# EAGLE board ISA Sound Card (EAGLE 9.0.1), part 1 of 2
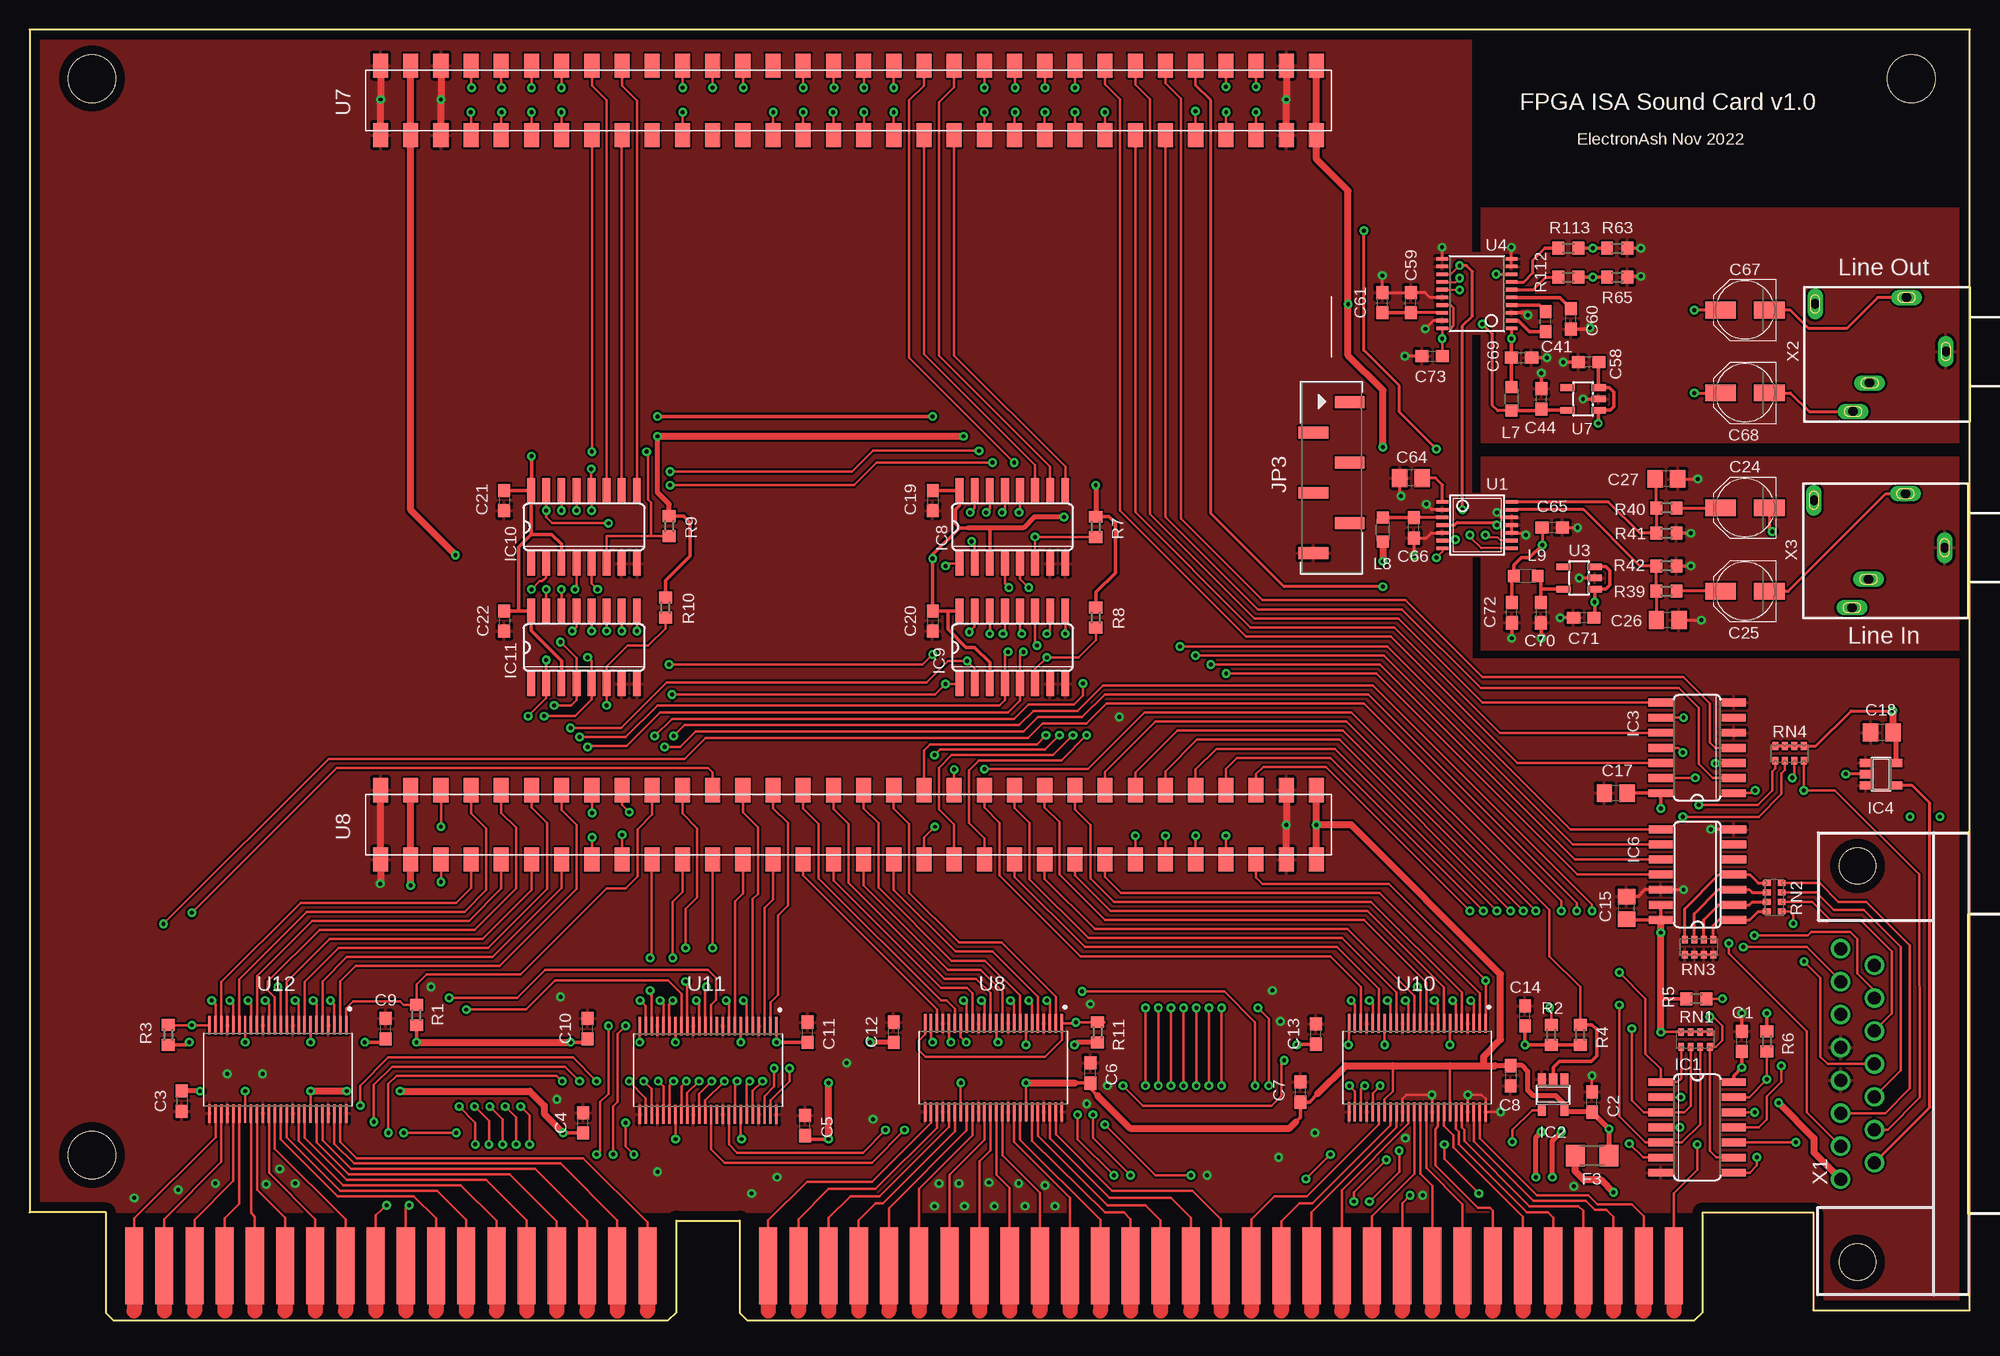
[diagram p4: board, top side]
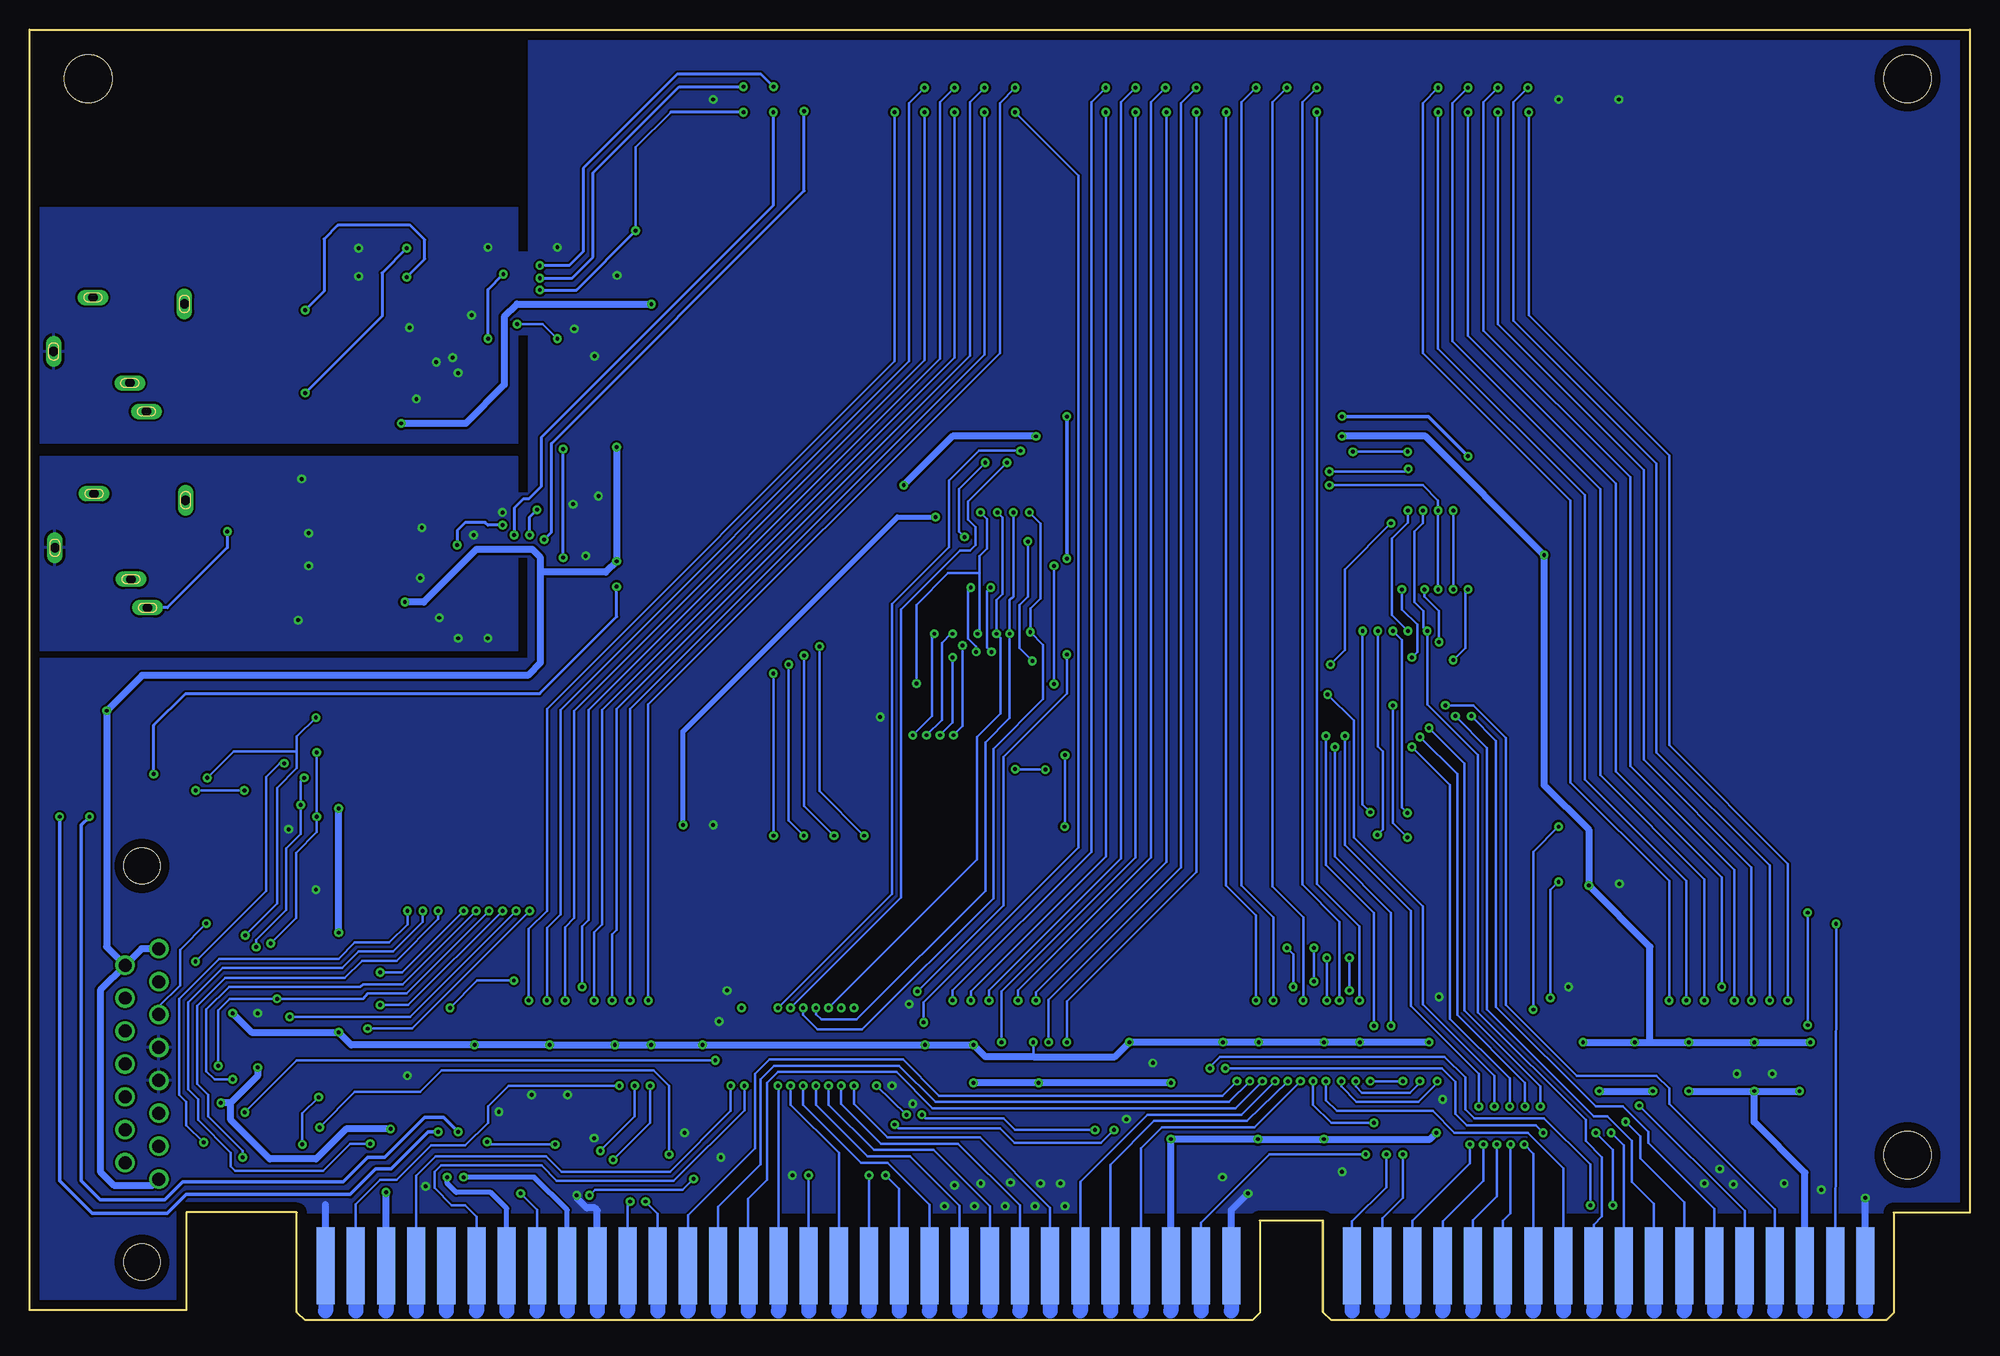
[diagram p5: board, bottom side, seen from below]

Size 163.22 x 108.58 mm. Coordinates in mm from the lower left corner, seen from the top.
Outline: 6.4,9.07 6.4,0.61 7.01,0 53.72,0 54.41,0.69 54.41,8.38 59.74,8.38 59.74,0.61 60.35,0 140.06,0 140.74,0.69 140.74,9.07 150.04,9.07 150.04,0.84 163.22,0.84 163.22,108.59 0,108.59 0,9.07 6.4,9.07
Copper layers (1*16): Top 0.035mm / dielectric 1.5mm / Bottom 0.035mm
Design rules "default *": minimum track width 6mil, minimum drill 13mil, track to track 7mil, track to pad 7mil, pad to pad 7mil, via to via 7mil, smd to smd 7mil, copper to edge 30mil, drill to drill 8mil, minimum pad ring 10mil, minimum via ring 8mil, stop-mask expansion 4mil, vias tented up to drill 25mil, thermal gap 10mil
Net classes: 2 gnd: width 0.152 mm, drill 0.3 mm, clearance 0.203 mm
Holes 4 mm at 5.23,104.47 5.23,13.89 158.3,104.47

## Footprints (pad centres in the part's own frame; a part is rotated, then mirrored left to right if it is on the bottom)
C0603 = smd 1.1 x 1: 1 -0.85,0; 2 0.85,0
C0805 = smd 1.3 x 1.5: 1 -0.95,0; 2 0.95,0
PANASONIC_C = smd 2.6 x 1.4: + 2.05,0; - -2.05,0
QMTECH_EP4CE15_SMD = smd 2.5 x 1: JP3_1 42.16,35.56; JP3_2 39.12,33.02; JP3_3 42.16,30.48; JP3_4 39.12,27.94; JP3_5 42.16,25.4; JP3_6 39.12,22.86 | smd 1.27 x 2.032: U7_1 -39.37,58.039; U7_2 -39.37,63.881; U7_3 -36.83,58.039; U7_4 -36.83,63.881; U7_5 -34.29,58.039; U7_6 -34.29,63.881; U7_7 -31.75,58.039; U7_8 -31.75,63.881; U7_9 -29.21,58.039; U7_10 -29.21,63.881; U7_11 -26.67,58.039; U7_12 -26.67,63.881; U7_13 -24.13,58.039; U7_14 -24.13,63.881; U7_15 -21.59,58.039; U7_16 -21.59,63.881; U7_17 -19.05,58.039; U7_18 -19.05,63.881; U7_19 -16.51,58.039; U7_20 -16.51,63.881; U7_21 -13.97,58.039; U7_22 -13.97,63.881; U7_23 -11.43,58.039; U7_24 -11.43,63.881; U7_25 -8.89,58.039; U7_26 -8.89,63.881; U7_27 -6.35,58.039; U7_28 -6.35,63.881; U7_29 -3.81,58.039; U7_30 -3.81,63.881; U7_31 -1.27,58.039; U7_32 -1.27,63.881; U7_33 1.27,58.039; U7_34 1.27,63.881; U7_35 3.81,58.039; U7_36 3.81,63.881; U7_37 6.35,58.039; U7_38 6.35,63.881; U7_39 8.89,58.039; U7_40 8.89,63.881; U7_41 11.43,58.039; U7_42 11.43,63.881; U7_43 13.97,58.039; U7_44 13.97,63.881; U7_45 16.51,58.039; U7_46 16.51,63.881; U7_47 19.05,58.039; U7_48 19.05,63.881; U7_49 21.59,58.039; U7_50 21.59,63.881; U7_51 24.13,58.039; U7_52 24.13,63.881; U7_53 26.67,58.039; U7_54 26.67,63.881; U7_55 29.21,58.039; U7_56 29.21,63.881; U7_57 31.75,58.039; U7_58 31.75,63.881; U7_59 34.29,58.039; U7_60 34.29,63.881; U7_61 36.83,58.039; U7_62 36.83,63.881; U7_63 39.37,58.039; U7_64 39.37,63.881; U8_1 -39.37,-2.921; U8_2 -39.37,2.921; U8_3 -36.83,-2.921; U8_4 -36.83,2.921; U8_5 -34.29,-2.921; U8_6 -34.29,2.921; U8_7 -31.75,-2.921; U8_8 -31.75,2.921; U8_9 -29.21,-2.921; U8_10 -29.21,2.921; U8_11 -26.67,-2.921; U8_12 -26.67,2.921; U8_13 -24.13,-2.921; U8_14 -24.13,2.921; U8_15 -21.59,-2.921; U8_16 -21.59,2.921; U8_17 -19.05,-2.921; U8_18 -19.05,2.921; U8_19 -16.51,-2.921; U8_20 -16.51,2.921; U8_21 -13.97,-2.921; U8_22 -13.97,2.921; U8_23 -11.43,-2.921; U8_24 -11.43,2.921; U8_25 -8.89,-2.921; U8_26 -8.89,2.921; U8_27 -6.35,-2.921; U8_28 -6.35,2.921; U8_29 -3.81,-2.921; U8_30 -3.81,2.921; U8_31 -1.27,-2.921; U8_32 -1.27,2.921; U8_33 1.27,-2.921; U8_34 1.27,2.921; U8_35 3.81,-2.921; U8_36 3.81,2.921; U8_37 6.35,-2.921; U8_38 6.35,2.921; U8_39 8.89,-2.921; U8_40 8.89,2.921; U8_41 11.43,-2.921; U8_42 11.43,2.921; U8_43 13.97,-2.921; U8_44 13.97,2.921; U8_45 16.51,-2.921; U8_46 16.51,2.921; U8_47 19.05,-2.921; U8_48 19.05,2.921; U8_49 21.59,-2.921; U8_50 21.59,2.921; U8_51 24.13,-2.921; U8_52 24.13,2.921; U8_53 26.67,-2.921; U8_54 26.67,2.921; U8_55 29.21,-2.921; U8_56 29.21,2.921; U8_57 31.75,-2.921; U8_58 31.75,2.921; U8_59 34.29,-2.921; U8_60 34.29,2.921; U8_61 36.83,-2.921; U8_62 36.83,2.921; U8_63 39.37,-2.921; U8_64 39.37,2.921
R1206 = smd 1.6 x 1.803: 1 -1.422,0; 2 1.422,0
SO14 = smd 0.66 x 2.032: 1 -3.81,-3.073; 2 -2.54,-3.073; 3 -1.27,-3.073; 4 0,-3.073; 5 1.27,-3.073; 6 2.54,-3.073; 7 3.81,-3.073; 8 3.81,3.073; 9 2.54,3.073; 10 1.27,3.073; 11 0,3.073; 12 -1.27,3.073; 13 -2.54,3.073; 14 -3.81,3.073
SOT23-5 = smd 0.69 x 0.99: 1 -0.95,-1.29; 2 0,-1.29; 3 0.95,-1.29; 4 0.95,1.3; 5 -0.95,1.3
SO16 = smd 0.66 x 2.032: 1 -4.445,-3.073; 2 -3.175,-3.073; 3 -1.905,-3.073; 4 -0.635,-3.073; 5 0.635,-3.073; 6 1.905,-3.073; 7 3.175,-3.073; 8 4.445,-3.073; 9 4.445,3.073; 10 3.175,3.073; 11 1.905,3.073; 12 0.635,3.073; 13 -0.635,3.073; 14 -1.905,3.073; 15 -3.175,3.073; 16 -4.445,3.073
IBM-AT = smd 1.524 x 6.477: A1 64.77,0.635; A2 62.23,0.635; A3 59.69,0.635; A4 57.15,0.635; A5 54.61,0.635; A6 52.07,0.635; A7 49.53,0.635; A8 46.99,0.635; A9 44.45,0.635; A10 41.91,0.635; A11 39.37,0.635; A12 36.83,0.635; A13 34.29,0.635; A14 31.75,0.635; A15 29.21,0.635; A16 26.67,0.635; A17 24.13,0.635; A18 21.59,0.635; A19 19.05,0.635; A20 16.51,0.635; A21 13.97,0.635; A22 11.43,0.635; A23 8.89,0.635; A24 6.35,0.635; A25 3.81,0.635; A26 1.27,0.635; A27 -1.27,0.635; A28 -3.81,0.635; A29 -6.35,0.635; A30 -8.89,0.635; A31 -11.43,0.635; C1 -21.59,0.635; C2 -24.13,0.635; C3 -26.67,0.635; C4 -29.21,0.635; C5 -31.75,0.635; C6 -34.29,0.635; C7 -36.83,0.635; C8 -39.37,0.635; C9 -41.91,0.635; C10 -44.45,0.635; C11 -46.99,0.635; C12 -49.53,0.635; C13 -52.07,0.635; C14 -54.61,0.635; C15 -57.15,0.635; C16 -59.69,0.635; C17 -62.23,0.635; C18 -64.77,0.635 | smd 1.524 x 6.477 bottom: B1 64.77,0.635; B2 62.23,0.635; B3 59.69,0.635; B4 57.15,0.635; B5 54.61,0.635; B6 52.07,0.635; B7 49.53,0.635; B8 46.99,0.635; B9 44.45,0.635; B10 41.91,0.635; B11 39.37,0.635; B12 36.83,0.635; B13 34.29,0.635; B14 31.75,0.635; B15 29.21,0.635; B16 26.67,0.635; B17 24.13,0.635; B18 21.59,0.635; B19 19.05,0.635; B20 16.51,0.635; B21 13.97,0.635; B22 11.43,0.635; B23 8.89,0.635; B24 6.35,0.635; B25 3.81,0.635; B26 1.27,0.635; B27 -1.27,0.635; B28 -3.81,0.635; B29 -6.35,0.635; B30 -8.89,0.635; B31 -11.43,0.635; D1 -21.59,0.635; D2 -24.13,0.635; D3 -26.67,0.635; D4 -29.21,0.635; D5 -31.75,0.635; D6 -34.29,0.635; D7 -36.83,0.635; D8 -39.37,0.635; D9 -41.91,0.635; D10 -44.45,0.635; D11 -46.99,0.635; D12 -49.53,0.635; D13 -52.07,0.635; D14 -54.61,0.635; D15 -57.15,0.635; D16 -59.69,0.635; D17 -62.23,0.635; D18 -64.77,0.635
L2012C = smd 1 x 1: 1 -1,0; 2 1,0
R0603 = smd 1 x 1.1: 1 -0.85,0; 2 0.85,0
0603-ARC = smd 0.5 x 0.65: 1 -1.2,-0.625; 2 -0.4,-0.625; 3 0.4,-0.625; 4 1.2,-0.625; 5 1.2,0.625; 6 0.4,0.625; 7 -0.4,0.625; 8 -1.2,0.625
TSSOP14 = smd 0.305 x 0.991: 1 -1.95,-2.918; 2 -1.3,-2.918; 3 -0.65,-2.918; 4 0,-2.918; 5 0.65,-2.918; 6 1.3,-2.918; 7 1.95,-2.918; 8 1.95,2.918; 9 1.3,2.918; 10 0.65,2.918; 11 0,2.918; 12 -0.65,2.918; 13 -1.3,2.918; 14 -1.95,2.918
SOT23-5' = smd 0.55 x 1.2: 1 -0.95,-1.3; 2 0,-1.3; 3 0.95,-1.3; 4 0.95,1.3; 5 -0.95,1.3
TSSOP20 = smd 0.305 x 0.991: 1 -2.925,-2.918; 2 -2.275,-2.918; 3 -1.625,-2.918; 4 -0.975,-2.918; 5 -0.325,-2.918; 6 0.325,-2.918; 7 0.975,-2.918; 8 1.625,-2.918; 9 2.275,-2.918; 10 2.925,-2.918; 11 2.925,2.918; 12 2.275,2.918; 13 1.625,2.918; 14 0.975,2.918; 15 0.325,2.918; 16 -0.325,2.918; 17 -0.975,2.918; 18 -1.625,2.918; 19 -2.275,2.918; 20 -2.925,2.918
SOP50P810X120-48N = smd 1.57 x 0.28: 1 -3.72,5.75; 2 -3.72,5.25; 3 -3.72,4.75; 4 -3.72,4.25; 5 -3.72,3.75; 6 -3.72,3.25; 7 -3.72,2.75; 8 -3.72,2.25; 9 -3.72,1.75; 10 -3.72,1.25; 11 -3.72,0.75; 12 -3.72,0.25; 13 -3.72,-0.25; 14 -3.72,-0.75; 15 -3.72,-1.25; 16 -3.72,-1.75; 17 -3.72,-2.25; 18 -3.72,-2.75; 19 -3.72,-3.25; 20 -3.72,-3.75; 21 -3.72,-4.25; 22 -3.72,-4.75; 23 -3.72,-5.25; 24 -3.72,-5.75; 25 3.72,-5.75; 26 3.72,-5.25; 27 3.72,-4.75; 28 3.72,-4.25; 29 3.72,-3.75; 30 3.72,-3.25; 31 3.72,-2.75; 32 3.72,-2.25; 33 3.72,-1.75; 34 3.72,-1.25; 35 3.72,-0.75; 36 3.72,-0.25; 37 3.72,0.25; 38 3.72,0.75; 39 3.72,1.25; 40 3.72,1.75; 41 3.72,2.25; 42 3.72,2.75; 43 3.72,3.25; 44 3.72,3.75; 45 3.72,4.25; 46 3.72,4.75; 47 3.72,5.25; 48 3.72,5.75
H5R15RA = drill 1.092: 1 9.69,1.422; 2 6.921,1.422; 3 4.153,1.422; 4 1.384,1.422; 5 -1.384,1.422; 6 -4.153,1.422; 7 -6.921,1.422; 8 -9.69,1.422; 9 8.306,-1.422; 10 5.537,-1.422; 11 2.769,-1.422; 12 0,-1.422; 13 -2.769,-1.422; 14 -5.537,-1.422; 15 -8.306,-1.422 | hole 3.048: -16.662,0; 16.662,0
1503_09 = drill 0.8 pad 1.2 long: 1 0,-2.1; 2 -4.55,-5.4; 3 5.05,-9.9; 4 -4,-13.1; 5 2.65,-8.5

## Placement (x,y rotation side)
C1  100nF  [C0603]  144.04,23.47 90 top
C2  100nF  [C0603]  131.44,18.36 90 top
C3  100nF  [C0603]  12.8,18.44 270 top
C4  100nF  [C0603]  46.56,16.61 90 top
C5  100nF  [C0603]  65.23,16.38 90 top
C6  100nF  [C0603]  89.23,20.8 90 top
C7  100nF  [C0603]  106.91,19.2 90 top
C8  100nF  [C0603]  124.59,20.57 270 top
C9  100nF  [C0603]  29.95,24.54 90 top
C10  100nF  [C0603]  46.94,24.54 90 top
C11  100nF  [C0603]  65.45,24.23 90 top
C12  100nF  [C0603]  72.69,24.23 90 top
C13  100nF  [C0603]  108.2,24.08 90 top
C14  100nF  [C0603]  125.81,25.6 90 top
C15  100nF  [C0805]  134.34,34.7 90 top
C17  100nF  [C0805]  133.43,44.35 180 top
C18  100nF  [C0805]  155.83,49.45 180 top
C19  100nF  [C0603]  75.97,68.96 270 top
C20  100nF  [C0603]  75.97,58.83 270 top
C21  100nF  [C0603]  39.93,68.96 270 top
C22  100nF  [C0603]  39.93,58.83 270 top
C24  100uF  [PANASONIC_C]  144.3,68.35 180 top
C25  100uF  [PANASONIC_C]  144.3,61.34 180 top
C26  1nF  [C0805]  137.8,58.9 180 top
C27  1nF  [C0805]  137.7,70.79 180 top
C41  2.2uF  [C0603]  127.54,84.02 90 top
C44  10uF  [C0603]  127.18,77.52 90 top
C58  100nF  [C0603]  131.14,80.62 180 top
C59  10uF  [C0603]  116.18,85.62 90 top
C60  2.2uF  [C0603]  129.67,84.25 90 top
C61  100nF  [C0603]  113.8,85.62 90 top
C64  100nF  [C0805]  116.21,70.87 180 top
C65  2.2uF  [C0603]  128.09,66.68 180 top
C66  100nF  [C0603]  116.44,66.67 90 top
C67  100uF  [PANASONIC_C]  144.3,84.99 180 top
C68  100uF  [PANASONIC_C]  144.3,78.02 180 top
C69  2.2uF  [C0603]  125.51,81 0 top
C70  10uF  [C0603]  127.12,59.54 270 top
C71  100nF  [C0603]  130.74,59.11 180 top
C72  100nF  [C0603]  124.68,59.54 90 top
C73  100nF  [C0603]  117.99,81.13 0 top
CYC_IV_  QMTECH_EP4CE15  [QMTECH_EP4CE15_SMD]  68.88,41.68 0 top
F3  500mA  [R1206]  131.44,13.87 180 top
IC1  74LS07D  [SO14]  140.28,16.23 270 top
IC2  74AHC1G07DBV  [SOT23-5]  128.17,18.97 180 top
IC3  74AC14D  [SO14]  140.28,48.16 90 top
IC4  74LVC1G125DBV  [SOT23-5]  155.75,45.95 270 top
IC6  MCP3004  [SO14]  140.31,37.5 90 top
IC8  4051D  [SO16]  82.68,66.75 0 top
IC9  4051D  [SO16]  82.68,56.62 0 top
IC10  4051D  [SO16]  46.63,66.75 0 top
IC11  4051D  [SO16]  46.63,56.62 0 top
ISA  [IBM-AT]  73.56,3.94 0 top
L7  [L2012C]  124.67,77.52 90 top
L8  [L2012C]  113.85,66.52 90 top
L9  [L2012C]  125.86,62.61 180 top
R1  4K7  [R0603]  32.54,25.68 90 top
R2  4K7  [R0603]  128.02,24 90 top
R3  4K7  [R0603]  11.66,24 90 top
R4  4K7  [R0603]  130.45,24 90 top
R5  4K7  [R0603]  140.21,27.05 0 top
R6  4K7  [R0603]  146.15,23.47 270 top
R7  4K7  [R0603]  89.69,66.75 90 top
R8  4K7  [R0603]  89.69,59.13 90 top
R9  4K7  [R0603]  53.8,66.83 90 top
R10  4K7  [R0603]  53.49,59.97 90 top
R11  4K7  [R0603]  89.84,24.23 90 top
R39  1K  [R0603]  137.7,61.34 180 top
R40  1K  [R0603]  137.7,68.35 180 top
R41  1K  [R0603]  137.7,66.22 180 top
R42  1K  [R0603]  137.7,63.47 180 top
R63  1K1  [R0603]  133.56,90.2 0 top
R65  1K1  [R0603]  133.56,87.76 0 top
R112  1K1  [R0603]  129.44,87.76 180 top
R113  1K1  [R0603]  129.44,90.2 180 top
RN1  2K2  [0603-ARC]  140.13,23.62 0 top
RN2  10K  [0603-ARC]  146.76,35.59 90 top
RN3  2K2  [0603-ARC]  140.44,31.39 0 top
RN4  10K  [0603-ARC]  148.06,47.7 0 top
U1  PCM1808  [TSSOP14]  121.77,66.9 270 top
U3  MIC5365-3.3YD5-TR  [SOT23-5']  130.36,62.46 90 top
U4  PCM5102  [TSSOP20]  121.75,86.39 90 top
U7  MIC5365-3.3YD5-TR  [SOT23-5']  130.69,77.52 90 top
U8  SN74LVC16T245DGGR  [SOP50P810X120-48N]  81.08,21.26 270 top
U10  SN74LVC16T245DGGR  [SOP50P810X120-48N]  116.74,21.26 270 top
U11  SN74LVC16T245DGGR  [SOP50P810X120-48N]  57.07,21.03 270 top
U12  SN74LVC16T245DGGR  [SOP50P810X120-48N]  20.88,21.11 270 top
X1  D-SUB15-H5R15RA  [H5R15RA]  153.77,21.56 90 top
X2  LINE_OUT  [1503_09]  163.3,81.51 270 top
X3  LINE_IN  [1503_09]  163.2,65 270 top